# Altium schematic sheet topologia_puente.SchDoc
size A4
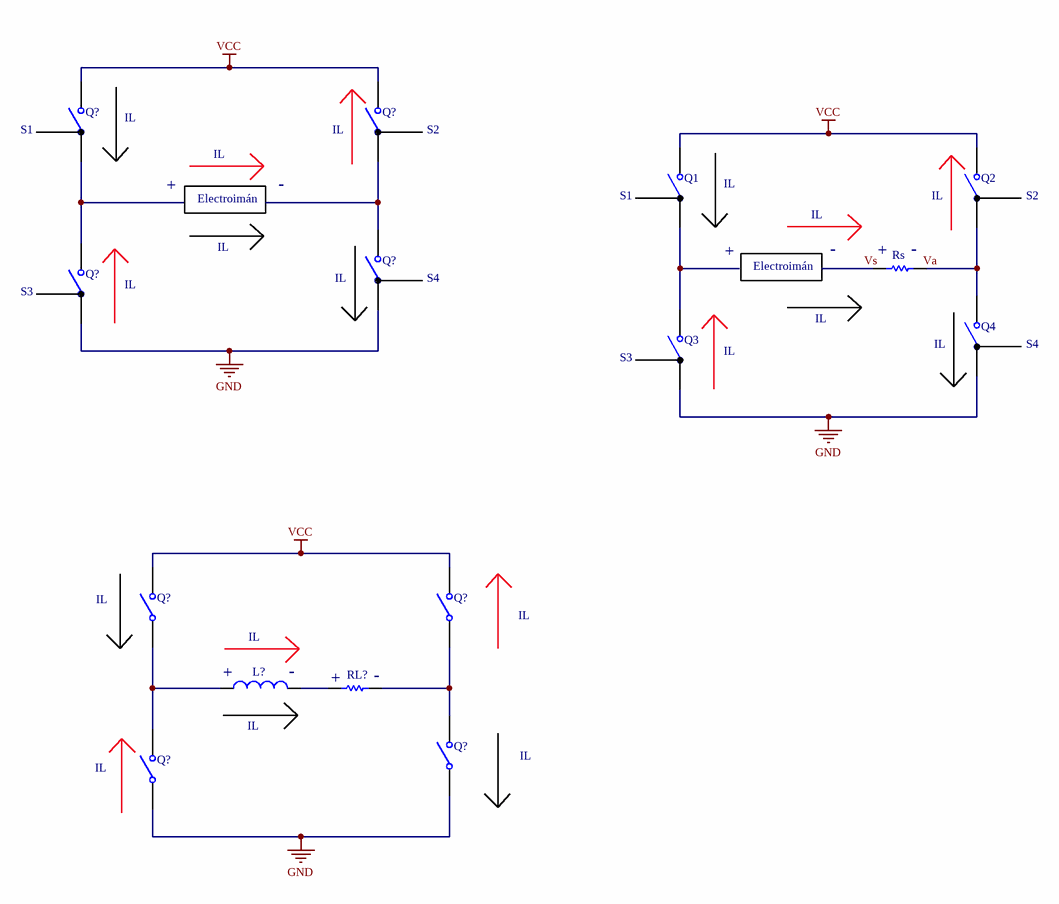
[diagram p0: topologia_puente.SchDoc]

## Parts
(Parts that share a designator on the sheet are numbered #1, #2 ... from top to bottom, then left to right.)
L?  Inductor  [0402-A]  (value not drawn)
Q1  SW-SPST  [SPST-2]  (value not drawn)
Q2  SW-SPST  [SPST-2]  (value not drawn)
Q3  SW-SPST  [SPST-2]  (value not drawn)
Q4  SW-SPST  [SPST-2]  (value not drawn)
Q?#1  SW-SPST  [SPST-2]  (value not drawn)
Q?#2  SW-SPST  [SPST-2]  (value not drawn)
Q?#3  SW-SPST  [SPST-2]  (value not drawn)
Q?#4  SW-SPST  [SPST-2]  (value not drawn)
Q?#5  SW-SPST  [SPST-2]  (value not drawn)
Q?#6  SW-SPST  [SPST-2]  (value not drawn)
Q?#7  SW-SPST  [SPST-2]  (value not drawn)
Q?#8  SW-SPST  [SPST-2]  (value not drawn)
RL?  Res1  [AXIAL-0.3]  (value not drawn)
Rs  Res1  [AXIAL-0.3]  (value not drawn)

## Nets
GND: Q3.1(COMMON) Q4.1(COMMON) Q?#3.1(COMMON) Q?#4.1(COMMON) Q?#7.1(COMMON) Q?#8.1(COMMON)
VCC: Q1.2(NO) Q2.2(NO) Q?#1.2(NO) Q?#2.2(NO) Q?#5.2(NO) Q?#6.2(NO)
Vs: Rs.1
NetL?_1: L?.1 Q?#5.1(COMMON) Q?#8.2(NO)
NetL?_2: L?.2 RL?.1
NetQ1_1: Q1.1(COMMON) Q3.2(NO)
NetQ2_1: Q2.1(COMMON) Q4.2(NO) Rs.2
NetQ?#1_1: Q?#1.1(COMMON) Q?#4.2(NO)
NetQ?#2_1: Q?#2.1(COMMON) Q?#3.2(NO)
NetQ?#6_1: Q?#6.1(COMMON) Q?#7.2(NO) RL?.2

## Notes on the sheet
- (near Q?#1) S1
- (near Q?#1) IL
- (near Q?#2) IL
- (near Q?#2) S2
- +
- Electroimán
- IL
- -
- (near Q1) S1
- (near Q1) IL
- (near Q2) IL
- (near Q2) S2
- (near Rs) -
- (near Rs) +
- (near Q?#4) S3
- (near Q?#4) IL
- (near Q?#3) IL
- (near Q?#3) S4
- (near Q3) S3
- (near Q3) IL
- (near Q4) IL
- (near Q4) S4
- (near Q?#5) IL
- (near L?) IL
- (near L?) +
- (near L?) -
- (near RL?) +
- (near RL?) -
- (near Q?#8) IL
- Labels drawn without touching a wire or pin: Va

## Library data of the parts
L? = Inductor: Code_IEC: 1005; Value: 10mH; Published: 8-Jun-2000; LatestRevisionDate: 29-May-2009; LatestRevisionNote: IPC-7351 Footprint Added.; PackageReference: 0402-A; Publisher: Altium Limited; PackageDescription: Chip Inductor; Code_JEITA: 0402
Q1-Q4 Q?#1-Q?#8 = SW-SPST: Single-Pole, Single-Throw Switch; Published: 24-Mar-1999; LatestRevisionDate: 17-Jul-2002; LatestRevisionNote: Re-released for DXP Platform.; PackageReference: SPST-2; Publisher: Altium Limited; PackageDescription: Switch; 2 Leads
RL? Rs = Res1: Resistor; Value: 1K; Published: 8-Jun-2000; LatestRevisionDate: 17-Jul-2002; LatestRevisionNote: Re-released for DXP Platform.; PackageReference: AXIAL-0.3; Publisher: Altium Limited; PackageDescription: Axial Device, Thru-Hole; 2 Leads; 0.3 in Pin Spacing